# EAGLE design MersenneTwister (EAGLE 6.3)
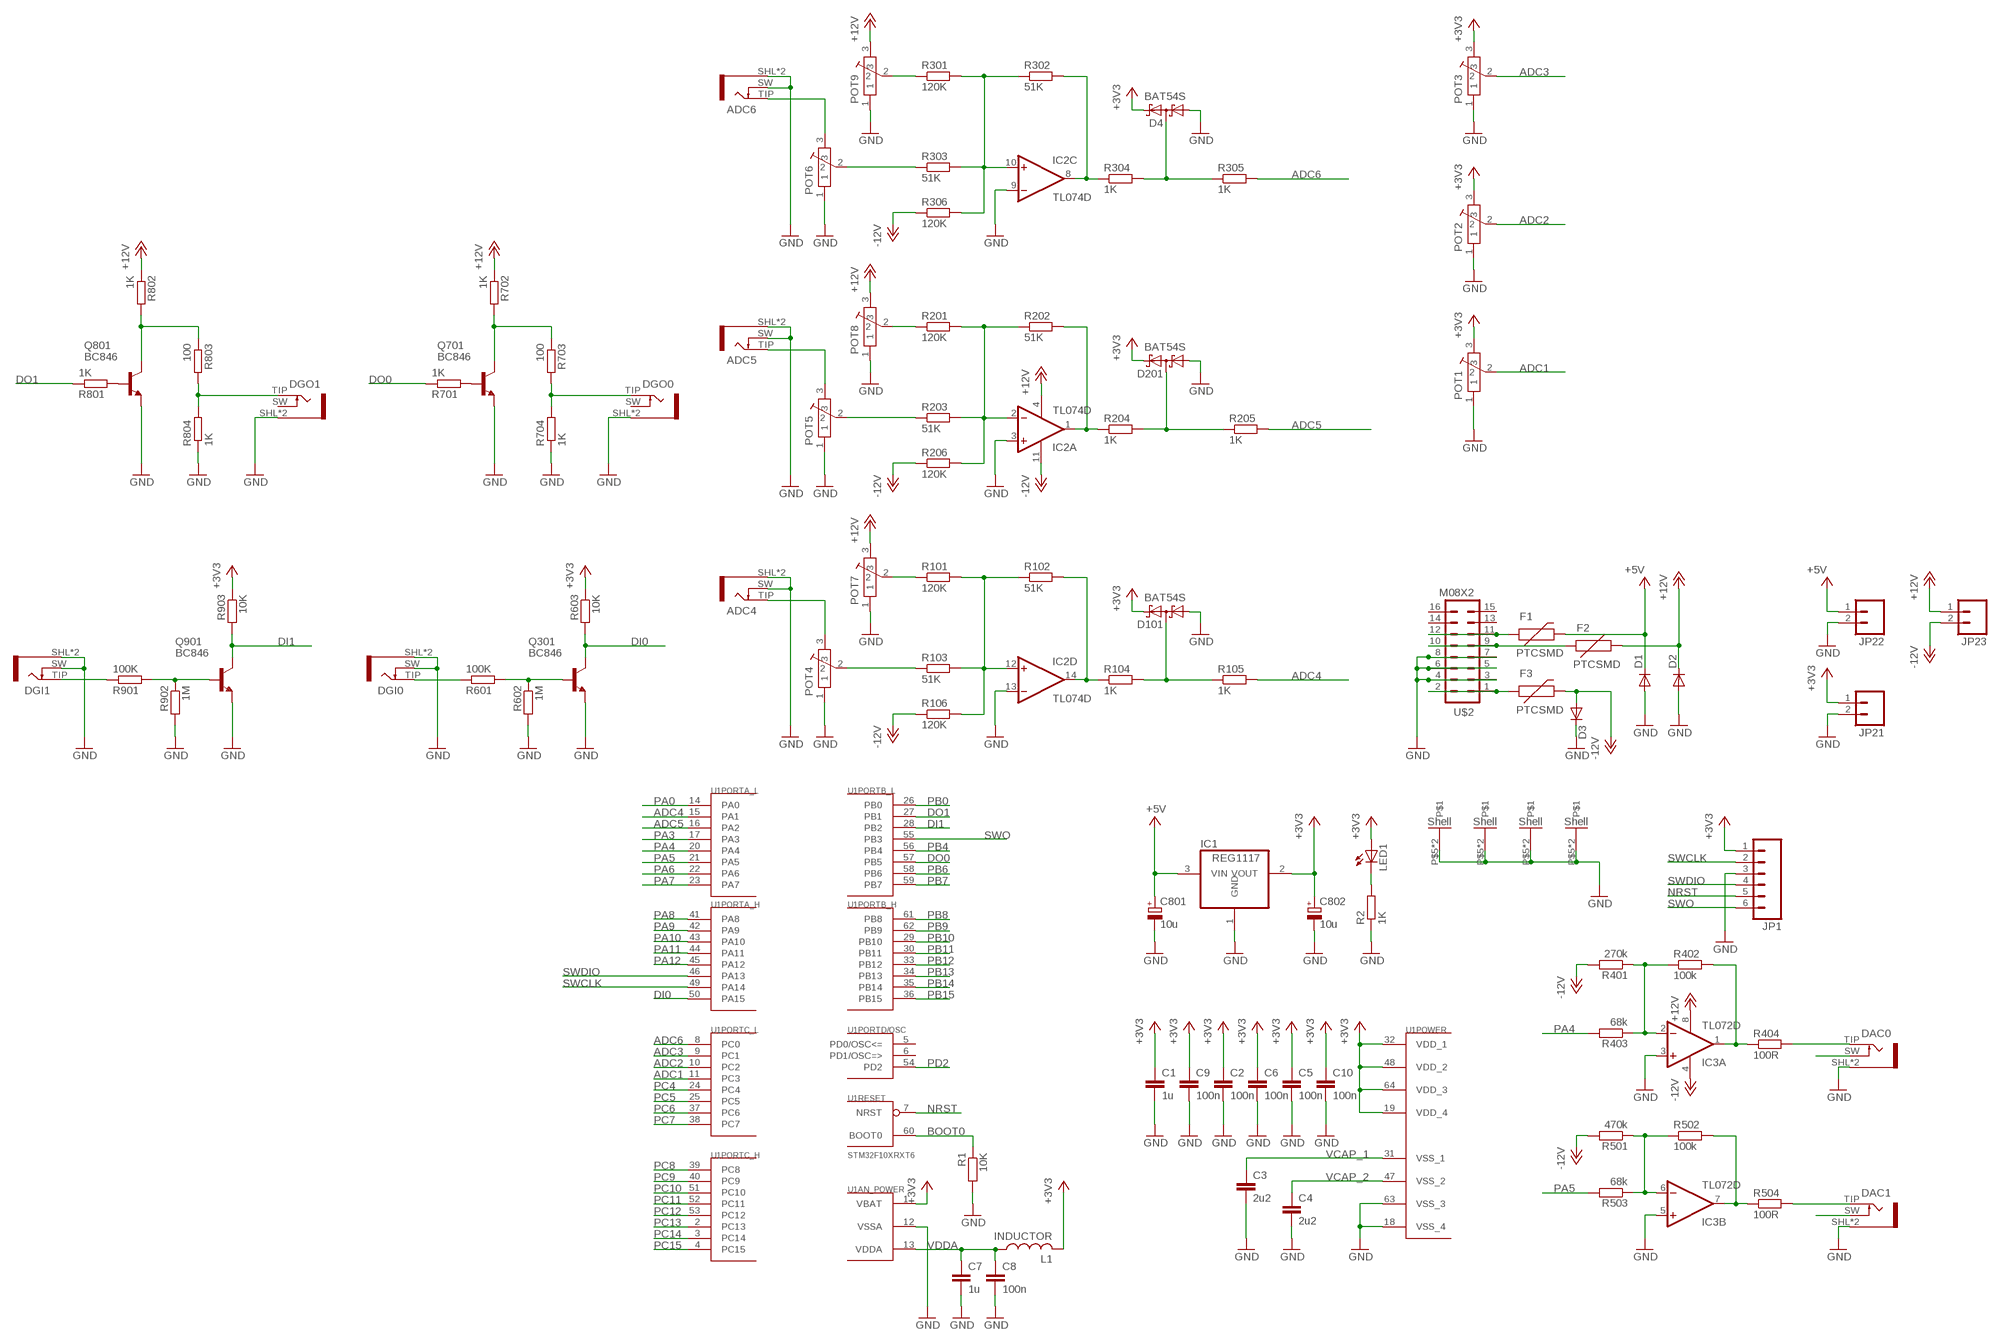
[diagram p0: schematic, sheet 1]

## Parts
ADC4  JACK-PJ-301B  [PJ-301B]
ADC5  JACK-PJ-301B  [PJ-301B]
ADC6  JACK-PJ-301B  [PJ-301B]
C1  1u  C-EUC0603  [C0603]
C2  100n  C-EUC0603  [C0603]
C3  2u2  C-EUC0603  [C0603]
C4  2u2  C-EUC0603  [C0603]
C5  100n  C-EUC0603  [C0603]
C6  100n  C-EUC0603  [C0603]
C7  1u  C-EUC0603  [C0603]
C8  100n  C-EUC0603  [C0603]
C9  100n  C-EUC0603  [C0603]
C10  100n  C-EUC0603  [C0603]
C801  10u  CPOL-EUA  [PANASONIC_A]
C802  10u  CPOL-EUA  [PANASONIC_A]
D1  DIODESMA  [SMA-DIODE]
D2  DIODESMA  [SMA-DIODE]
D3  DIODESMA  [SMA-DIODE]
D4  BAT54S  [SOT23]
D101  BAT54S  [SOT23]
D201  BAT54S  [SOT23]
DAC0  JACK-PJ-301B  [PJ-301B]
DAC1  JACK-PJ-301B  [PJ-301B]
DGI0  JACK-PJ-301B  [PJ-301B]
DGI1  JACK-PJ-301B  [PJ-301B]
DGO0  JACK-PJ-301B  [PJ-301B]
DGO1  JACK-PJ-301B  [PJ-301B]
F1  PTCSMD  [PTC-1206]
F2  PTCSMD  [PTC-1206]
F3  PTCSMD  [PTC-1206]
IC1  REG1117  [SOT223]
IC2  TL074D  [SO14]
IC3  TL072D  [SO08]
JP1  M06SIP  [1X06]
JP21  M02PTH  [1X02]
JP22  M02PTH  [1X02]
JP23  M02PTH  [1X02]
L1  INDUCTOR  [0603]
LED1  LEDCHIPLED_0603  [CHIPLED_0603]
POT1  POT-ALPS-RK09L1140  [POT-ALPS-RK09L1140]
POT2  POT-ALPS-RK09L1140  [POT-ALPS-RK09L1140]
POT3  POT-ALPS-RK09L1140  [POT-ALPS-RK09L1140]
POT4  POT-ALPS-RK09L1140  [POT-ALPS-RK09L1140]
POT5  POT-ALPS-RK09L1140  [POT-ALPS-RK09L1140]
POT6  POT-ALPS-RK09L1140  [POT-ALPS-RK09L1140]
POT7  POT-ALPS-RK09L1140  [POT-ALPS-RK09L1140]
POT8  POT-ALPS-RK09L1140  [POT-ALPS-RK09L1140]
POT9  POT-ALPS-RK09L1140  [POT-ALPS-RK09L1140]
Q301  BC846  [SOT23]
Q701  BC846  [SOT23]
Q801  BC846  [SOT23]
Q901  BC846  [SOT23]
R1  10K  R-EU_R0603  [R0603]
R2  1K  R-EU_R0603  [R0603]
R101  120K  R-EU_R0603  [R0603]
R102  51K  R-EU_R0603  [R0603]
R103  51K  R-EU_R0603  [R0603]
R104  1K  R-EU_R0603  [R0603]
R105  1K  R-EU_R0603  [R0603]
R106  120K  R-EU_R0603  [R0603]
R201  120K  R-EU_R0603  [R0603]
R202  51K  R-EU_R0603  [R0603]
R203  51K  R-EU_R0603  [R0603]
R204  1K  R-EU_R0603  [R0603]
R205  1K  R-EU_R0603  [R0603]
R206  120K  R-EU_R0603  [R0603]
R301  120K  R-EU_R0603  [R0603]
R302  51K  R-EU_R0603  [R0603]
R303  51K  R-EU_R0603  [R0603]
R304  1K  R-EU_R0603  [R0603]
R305  1K  R-EU_R0603  [R0603]
R306  120K  R-EU_R0603  [R0603]
R401  270k  R-EU_R0603  [R0603]
R402  100k  R-EU_R0603  [R0603]
R403  68k  R-EU_R0603  [R0603]
R404  100R  R-EU_R0603  [R0603]
R501  470k  R-EU_R0603  [R0603]
R502  100k  R-EU_R0603  [R0603]
R503  68k  R-EU_R0603  [R0603]
R504  100R  R-EU_R0603  [R0603]
R601  100K  R-EU_R0603  [R0603]
R602  1M  R-EU_R0603  [R0603]
R603  10K  R-EU_R0603  [R0603]
R701  1K  R-EU_R0603  [R0603]
R702  1K  R-EU_R0603  [R0603]
R703  100  R-EU_R0603  [R0603]
R704  1K  R-EU_R0603  [R0603]
R801  1K  R-EU_R0603  [R0603]
R802  1K  R-EU_R0603  [R0603]
R803  100  R-EU_R0603  [R0603]
R804  1K  R-EU_R0603  [R0603]
R901  100K  R-EU_R0603  [R0603]
R902  1M  R-EU_R0603  [R0603]
R903  10K  R-EU_R0603  [R0603]
U1  STM32F10XRXT6  [TQFP64]
U$2  M08X2  [2X8]

## Nets
+3V3: C1.1 C2.1 C5.1 C6.1 C9.1 C10.1 C802.+ D4.2(C2) D101.2(C2) D201.2(C2) IC1.2(VOUT) JP1.1 JP21.1 L1.2 LED1.A POT1.3 POT2.3 POT3.3 R603.1 R903.1 U1.1(AN_POWER:VBAT) U1.19(POWER:VDD_4) U1.32(POWER:VDD_1) U1.48(POWER:VDD_2) U1.64(POWER:VDD_3)
+5V: C801.+ D1.C F1.2 IC1.3(VIN) JP22.1
+12V: D2.C F2.2 IC2.4(P:V+) IC3.8(P:V+) JP23.1 POT7.3 POT8.3 POT9.3 R702.1 R802.1
-12V: D3.A F3.2 IC2.11(P:V-) IC3.4(P:V-) JP23.2 R106.1 R206.1 R306.1 R401.2 R501.2
ADC1: POT1.2 U1.11(PORTC_L:PC3)
ADC2: POT2.2 U1.10(PORTC_L:PC2)
ADC3: POT3.2 U1.9(PORTC_L:PC1)
ADC4: R105.2 U1.15(PORTA_L:PA1)
ADC5: R205.2 U1.16(PORTA_L:PA2)
ADC6: R305.2 U1.8(PORTC_L:PC0)
BOOT0: R1.1 U1.60(RESET:BOOT0)
DI0: Q301.3(C) R603.2 U1.50(PORTA_H:PA15)
DI1: Q901.3(C) R903.2 U1.28(PORTB_L:PB2)
DO0: R701.1 U1.57(PORTB_L:PB5)
DO1: R801.1 U1.27(PORTB_L:PB1)
GND: ADC4.SHL(SLEEVE) ADC4.SLV(SLEEVE) ADC4.SW ADC5.SHL(SLEEVE) ADC5.SLV(SLEEVE) ADC5.SW ADC6.SHL(SLEEVE) ADC6.SLV(SLEEVE) ADC6.SW C1.2 C2.2 C3.2 C4.2 C5.2 C6.2 C7.2 C8.2 C9.2 C10.2 C801.- C802.- D1.A D2.A D3.C D4.1(A1) D101.1(A1) D201.1(A1) DAC0.SHL(SLEEVE) DAC0.SLV(SLEEVE) DAC1.SHL(SLEEVE) DAC1.SLV(SLEEVE) DGI0.SHL(SLEEVE) DGI0.SLV(SLEEVE) DGI0.SW DGI1.SHL(SLEEVE) DGI1.SLV(SLEEVE) DGI1.SW DGO0.SHL(SLEEVE) DGO0.SLV(SLEEVE) DGO1.SHL(SLEEVE) DGO1.SLV(SLEEVE) IC1.1(GND) IC2.3(A:+IN) IC2.9(C:-IN) IC2.13(D:-IN) IC3.3(A:+IN) IC3.5(B:+IN) JP1.3 JP21.2 JP22.2 POT1.1 POT1.P$5 POT1.P$6 POT2.1 POT2.P$5 POT2.P$6 POT3.1 POT4.1 POT5.1 POT6.1 POT7.1 POT7.P$5 POT7.P$6 POT8.1 POT8.P$5 POT8.P$6 POT9.1 Q301.2(E) Q701.2(E) Q801.2(E) Q901.2(E) R1.2 R2.1 R602.2 R704.1 R804.1 R902.2 U1.12(AN_POWER:VSSA) U1.18(POWER:VSS_4) U1.63(POWER:VSS_3) U$2.3 U$2.4 U$2.5 U$2.6 U$2.7 U$2.8
N$1: ADC6.TIP POT6.3
N$2: IC2.12(D:+IN) R101.2 R102.1 R103.2 R106.2
N$3: POT7.2 R101.1
N$4: IC2.14(D:OUT) R102.2 R104.1
N$5: IC3.7(B:OUT) R502.2 R504.1
N$6: F3.1 U$2.1 U$2.2
N$7: IC3.1(A:OUT) R402.2 R404.1
N$8: DAC0.SW
N$9: IC2.10(C:+IN) R301.2 R302.1 R303.2 R306.2
N$10: Q901.1(B) R901.2 R902.1
N$11: Q801.1(B) R801.2
N$12: D201.3(C1A2) R204.2 R205.1
N$13: IC3.2(A:-IN) R401.1 R402.1 R403.1
N$14: IC2.2(A:-IN) R201.2 R202.1 R203.2 R206.2
N$15: POT8.2 R201.1
N$16: IC2.1(A:OUT) R202.2 R204.1
N$17: ADC5.TIP POT5.3
N$18: IC3.6(B:-IN) R501.1 R502.1 R503.1
N$19: LED1.C R2.2
N$20: D101.3(C1A2) R104.2 R105.1
N$21: DGI1.TIP R901.1
N$22: DGO1.TIP R803.2 R804.2
N$23: DGI0.TIP R601.1
N$24: Q801.3(C) R802.2 R803.1
N$25: POT5.2 R203.1
N$27: Q301.1(B) R601.2 R602.1
N$29: DAC1.SW
N$30: POT9.2 R301.1
N$31: DAC0.TIP R404.2
N$32: DAC1.TIP R504.2
N$33: IC2.8(C:OUT) R302.2 R304.1
N$34: Q701.1(B) R701.2
N$35: DGO0.TIP R703.2 R704.2
N$36: POT6.2 R303.1
N$37: D4.3(C1A2) R304.2 R305.1
N$38: Q701.3(C) R702.2 R703.1
N$39: ADC4.TIP POT4.3
N$40: POT4.2 R103.1
N$44: F1.1 U$2.11 U$2.12
N$45: F2.1 U$2.9 U$2.10
NRST: JP1.5 U1.7(RESET:NRST)
PA0: U1.14(PORTA_L:PA0)
PA3: U1.17(PORTA_L:PA3)
PA4: R403.2 U1.20(PORTA_L:PA4)
PA5: R503.2 U1.21(PORTA_L:PA5)
PA6: U1.22(PORTA_L:PA6)
PA7: U1.23(PORTA_L:PA7)
PA8: U1.41(PORTA_H:PA8)
PA9: U1.42(PORTA_H:PA9)
PA10: U1.43(PORTA_H:PA10)
PA11: U1.44(PORTA_H:PA11)
PA12: U1.45(PORTA_H:PA12)
PB0: U1.26(PORTB_L:PB0)
PB4: U1.56(PORTB_L:PB4)
PB6: U1.58(PORTB_L:PB6)
PB7: U1.59(PORTB_L:PB7)
PB8: U1.61(PORTB_H:PB8)
PB9: U1.62(PORTB_H:PB9)
PB10: U1.29(PORTB_H:PB10)
PB11: U1.30(PORTB_H:PB11)
PB12: U1.33(PORTB_H:PB12)
PB13: U1.34(PORTB_H:PB13)
PB14: U1.35(PORTB_H:PB14)
PB15: U1.36(PORTB_H:PB15)
PC4: U1.24(PORTC_L:PC4)
PC5: U1.25(PORTC_L:PC5)
PC6: U1.37(PORTC_L:PC6)
PC7: U1.38(PORTC_L:PC7)
PC8: U1.39(PORTC_H:PC8)
PC9: U1.40(PORTC_H:PC9)
PC10: U1.51(PORTC_H:PC10)
PC11: U1.52(PORTC_H:PC11)
PC12: U1.53(PORTC_H:PC12)
PC13: U1.2(PORTC_H:PC13)
PC14: U1.3(PORTC_H:PC14)
PC15: U1.4(PORTC_H:PC15)
PD2: U1.54(PORTD/OSC:PD2)
SWCLK: JP1.2 U1.49(PORTA_H:PA14)
SWDIO: JP1.4 U1.46(PORTA_H:PA13)
SWO: JP1.6 U1.55(PORTB_L:PB3)
VCAP_1: C3.1 U1.31(POWER:VSS_1)
VCAP_2: C4.1 U1.47(POWER:VSS_2)
VDDA: C7.1 C8.1 L1.1 U1.13(AN_POWER:VDDA)
Unconnected: DGO0.SW DGO1.SW IC2.5(B:+IN) IC2.6(B:-IN) IC2.7(B:OUT) POT3.P$5 POT3.P$6 POT4.P$5 POT4.P$6 POT5.P$5 POT5.P$6 POT6.P$5 POT6.P$6 POT9.P$5 POT9.P$6 U1.5(PORTD/OSC:PD0/OSC<=) U1.6(PORTD/OSC:PD1/OSC=>) U$2.13 U$2.14 U$2.15 U$2.16

## Library data of the parts
ADC4-ADC6 DAC0 DAC1 DGI0 DGI1 DGO0 DGO1 = Rebel:JACK-PJ-301B
C1-C10 = resistor:C-EU: CAPACITOR, European symbol
C801 C802 = resistor:CPOL-EU: POLARIZED CAPACITOR, European symbol
D1-D3 = SparkFun:DIODE: Diode These are standard reverse protection diodes and small signal diodes. SMA package can handle up to about 1A. SOD-323 can handle about 200mA. What the SOD-323 package when ordering, there are some mfgs out there that are 5-pin packages.
D4 D101 D201 = diode:BAT54S: Schottky Diodes Pin connection corrected 2011-05-04 Source: Fairchild .. BAT54.pdf
F1-F3 = SparkFun:PTC: Resettable Fuse PTC Resettable Fuse. Spark Fun Electronics SKU : COM-08357
IC1 = burr-brown:REG1117: 800mA and 1A Low Dropout (LDO) Positive Regulator 1.8V, 2.5V, 2.85V, 3.3V, 5V, and Adj; MPN: REG1117; OC_FARNELL: 1097566; OC_NEWARK: 14P6981
IC2 = linear:TL074: OP AMP
IC3 = linear:TL072: OP AMP
JP1 = SparkFun:M06: Header 6 Standard 6-pin 0.1" header. Use with straight break away headers (SKU : PRT-00116), right angle break away headers (PRT-00553), swiss pins (PRT-00743), machine pins (PRT-00117), and female headers (PRT-00115). Molex polarized connector foot print use with SKU : PRT-08094 with associated crimp pins and housings. NOTES ON THE VARIANTS LOCK and LOCK_LONGPADS... This footprint was designed to help hold the alignment of a through-hole component (i.e. 6-pin header) while soldering it into place. You may notice that each hole has been shifted either up or down by 0.005 of an inch from it's more standard position (which is a perfectly straight line). This slight alteration caused the pins (the squares in the middle) to touch the edges of the holes. Because they are alternating, it causes a "brace" to hold the component in place. 0.005 has proven to be the perfect amount of "off-center" position when using our standard breakaway headers. Although looks a little odd when you look at the bare footprint, once you have a header in there, the alteration is very hard to notice. Also, if you push a header all the way into place, it is covered up entirely on the bottom side. This idea of altering the position of holes to aid alignment will be further integrated into the Sparkfun Library for other footprints. It can help hold any component with 3 or more connection pins.
JP21-JP23 = SparkFun:M02: Header 2 Standard 2-pin 0.1" header. Use with straight break away headers (SKU : PRT-00116), right angle break away headers (PRT-00553), swiss pins (PRT-00743), machine pins (PRT-00117), and female headers (PRT-00115). Molex polarized connector foot print use with SKU : PRT-08233 with associated crimp pins and housings.
L1 = Rebel:INDUCTOR
LED1 = led:LED: LED OSRAM: - CHIPLED LG R971, LG N971, LY N971, LG Q971, LY Q971, LO R971, LY R971 LH N974, LH R974 LS Q976, LO Q976, LY Q976 LO Q996 - Hyper CHIPLED LW Q18S LB Q993, LB Q99A, LB R99A - SideLED LS A670, LO A670, LY A670, LG A670, LP A670 LB A673, LV A673, LT A673, LW A673 LH A674 LY A675 LS A676, LA A676, LO A676, LY A676, LW A676 LS A679, LY A679, LG A679 - Hyper Micro SIDELED® LS Y876, LA Y876, LO Y876, LY Y876 LT Y87S - SmartLED LW L88C, LW L88S LB L89C, LB L89S, LG L890 LS L89K, LO L89K, LY L89K LS L896, LA L896, LO L896, LY L896 - TOPLED LS T670, LO T670, LY T670, LG T670, LP T670 LSG T670, LSP T670, LSY T670, LOP T670, LYG T670 LG T671, LOG T671, LSG T671 LB T673, LV T673, LT T673, LW T673 LH T674 LS T676, LA T676, LO T676, LY T676, LB T676, LH T676, LSB T676, LW T676 LB T67C, LV T67C, LT T67C, LS T67K, LO T67K, LY T67K, LW E67C LS E67B, LA E67B, LO E67B, LY E67B, LB E67C, LV E67C, LT E67C LW T67C LS T679, LY T679, LG T679 LS T770, LO T770, LY T770, LG T770, LP T770 LB T773, LV T773, LT T773, LW T773 LH T774 LS E675, LA E675, LY E675, LS T675 LS T776, LA T776, LO T776, LY T776, LB T776 LHGB T686 LT T68C, LB T68C - Hyper Mini TOPLED® LB M676 - Mini TOPLED Santana® LG M470 LS M47K, LO M47K, LY M47K Source: http://www.osram.convergy.de LUXEON: - LUMILED® LXK2-PW12-R00, LXK2-PW12-S00, LXK2-PW14-U00, LXK2-PW14-V00 LXK2-PM12-R00, LXK2-PM12-S00, LXK2-PM14-U00 LXK2-PE12-Q00, LXK2-PE12-R00, LXK2-PE12-S00, LXK2-PE14-T00, LXK2-PE14-U00 LXK2-PB12-K00, LXK2-PB12-L00, LXK2-PB12-M00, LXK2-PB14-N00, LXK2-PB14-P00, LXK2-PB14-Q00 LXK2-PR12-L00, LXK2-PR12-M00, LXK2-PR14-Q00, LXK2-PR14-R00 LXK2-PD12-Q00, LXK2-PD12-R00, LXK2-PD12-S00 LXK2-PH12-R00, LXK2-PH12-S00 LXK2-PL12-P00, LXK2-PL12-Q00, LXK2-PL12-R00 Source: www.luxeon.com KINGBRIGHT: KA-3528ASYC Source: www.kingbright.com
POT1-POT9 = Rebel:POT-ALPS-RK09L
Q301 Q701 Q801 Q901 = transistor:BC846: NPN TRANSISTOR
R1 R2 R101-R106 R201-R206 R301-R306 R401-R404 R501-R504 R601-R603 R701-R704 R801-R804 R901-R903 = resistor:R-EU_: RESISTOR, European symbol
U1 = stm32:STM32F10XRXT6: STM32F101/103 64pin LQFP
U$2 = SparkFun:M08X2

## Board
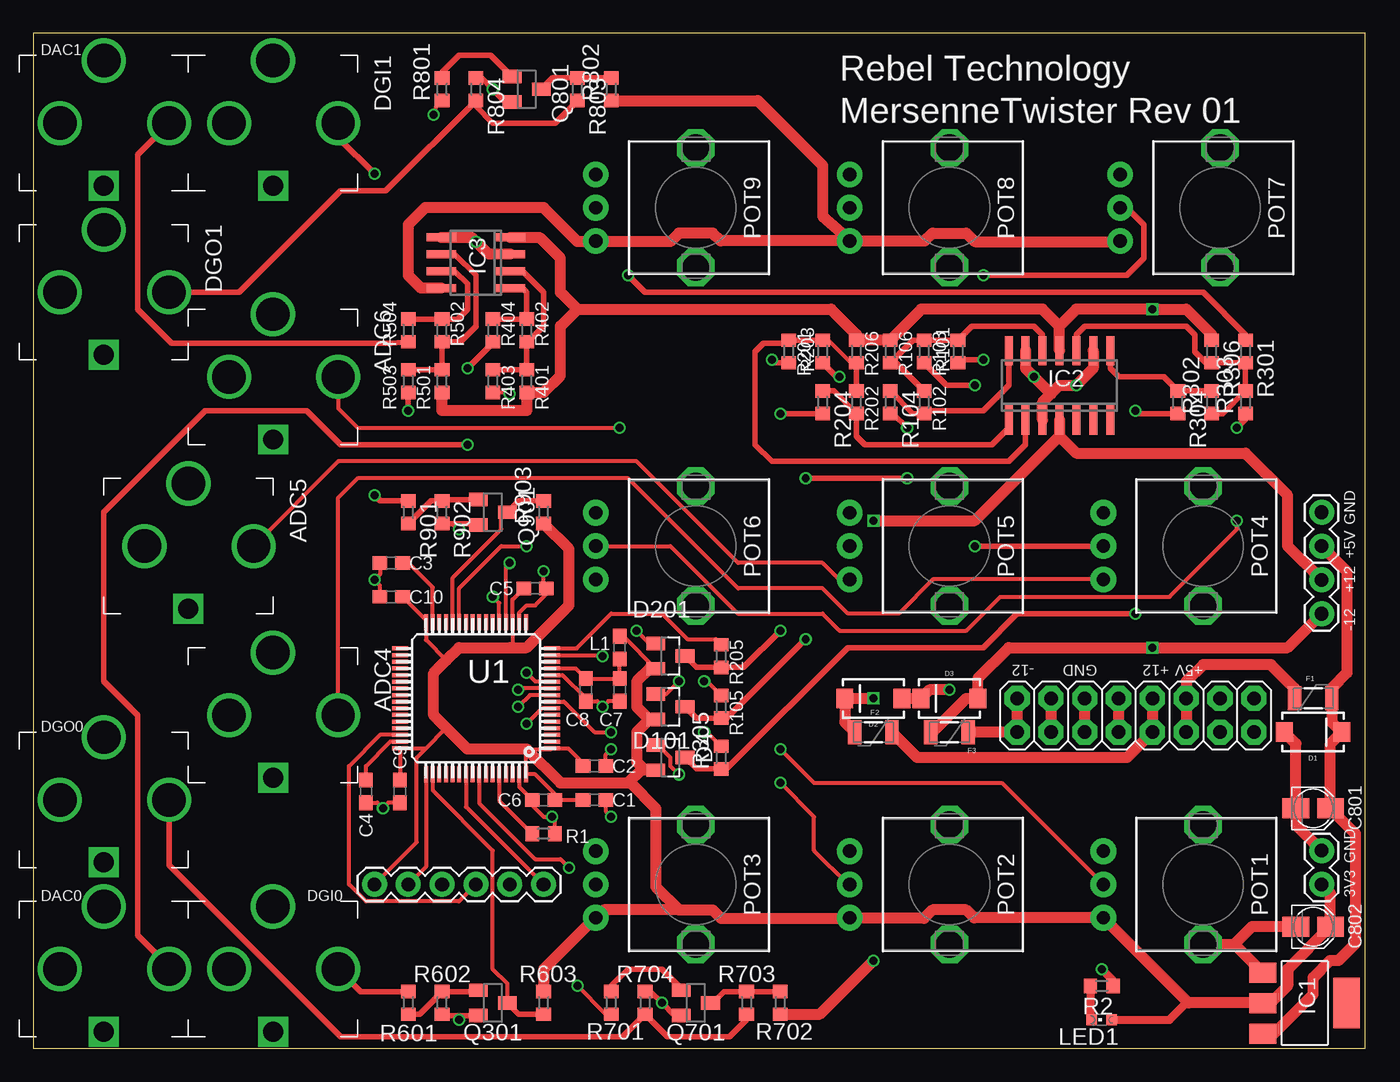
[diagram p1: board, top side]
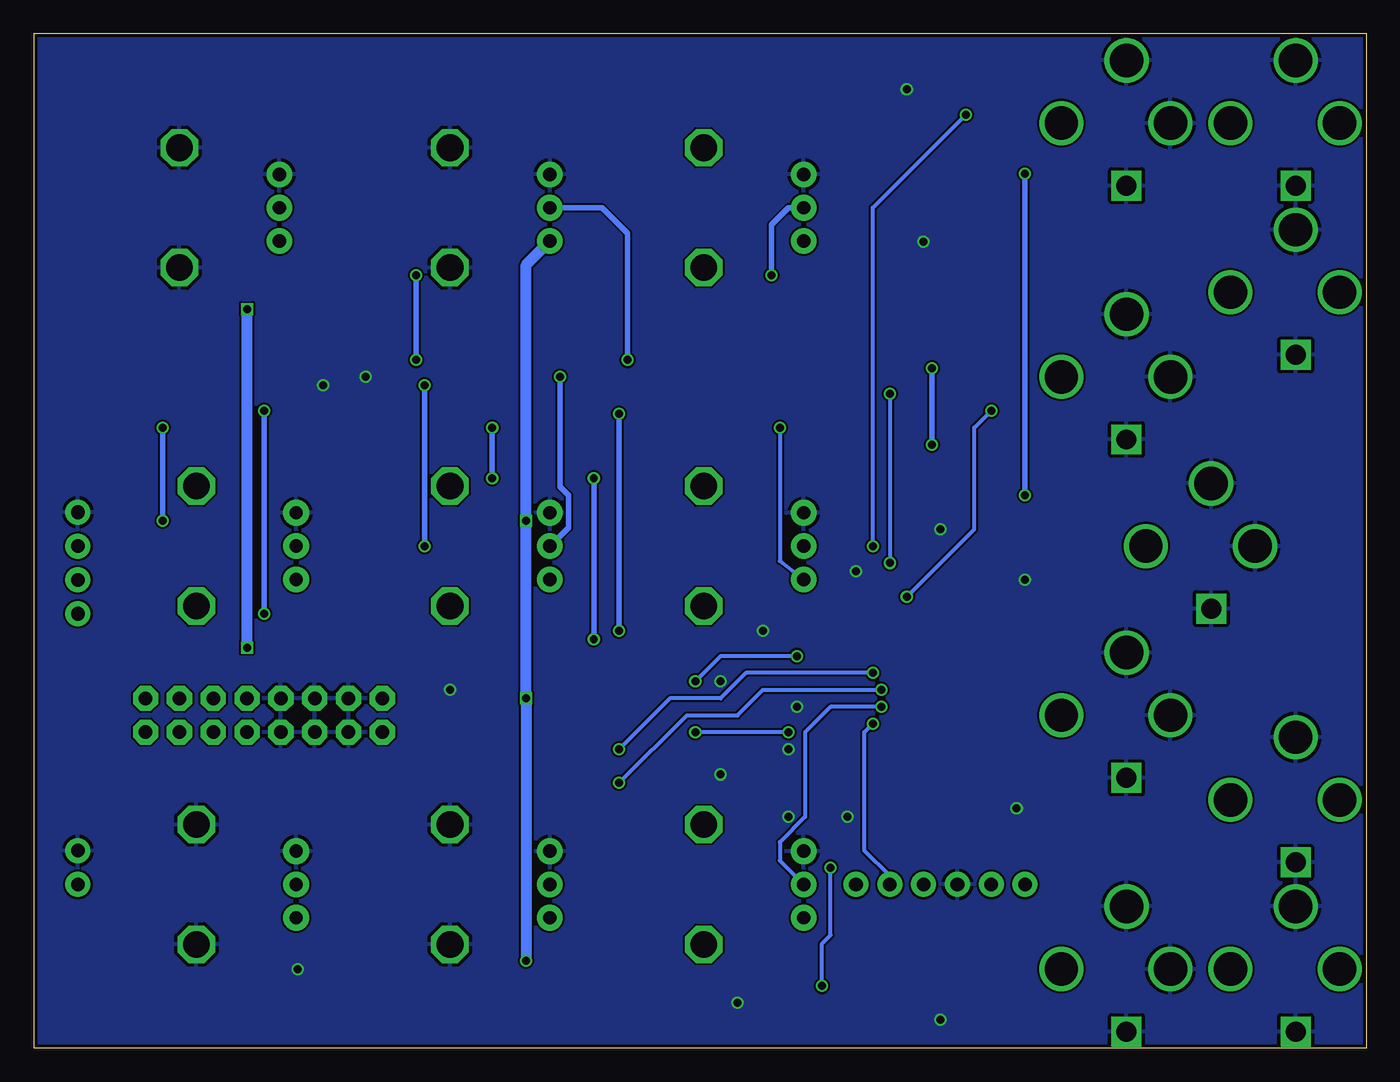
[diagram p2: board, bottom side, seen from below]

Size 100 x 76.19 mm. Coordinates in mm from the lower left corner, seen from the top.
Outline: 0,0 100,0 100,76.19 0,76.19 0,0
Copper layers (1*16): Top 0.035mm / dielectric 1.5mm / Bottom 0.035mm
Design rules "Rebel *": minimum track width 6mil, minimum drill 12mil, track to track 6mil, track to pad 6mil, pad to pad 6mil, via to via 6mil, smd to smd 0mil, copper to edge 10mil, drill to drill 10mil, minimum pad ring 12mil, minimum via ring 6mil, stop-mask expansion 2mil, vias tented up to drill 100mil, thermal gap 10mil

### Footprints (pad centres in the part's own frame; a part is rotated, then mirrored left to right if it is on the bottom)
PJ-301B = drill 1.5 square: SHL 4.7,0 | drill 2.5: SLV -4.7,0; SW 0,-3.3; TIP 0,4.9
C0603 = smd 1.1 x 1: 1 -0.85,0; 2 0.85,0
PANASONIC_A = smd 2 x 1.5: + 1.3,0; - -1.3,0
SMA-DIODE = smd 1.27 x 1.47: A -2.15,0; C 2.15,0
SOT23 = smd 1 x 1.4: 1 -0.95,-1.1; 2 0.95,-1.1; 3 0,1.1
PTC-1206 = smd 1 x 1.8: 1 -1.4,0; 2 1.4,0
SOT223 = smd 1.499 x 2.007: 1 -2.261,-3.15; 2 0.025,-3.15; 3 2.311,-3.15 | smd 3.81 x 2.007: 4 0,3.15
SO14 = smd 0.6 x 2.2: 1 -3.81,-2.6; 2 -2.54,-2.6; 3 -1.27,-2.6; 4 0,-2.6; 5 1.27,-2.6; 6 2.54,-2.6; 7 3.81,-2.6; 8 3.81,2.6; 9 2.54,2.6; 10 1.27,2.6; 11 0,2.6; 12 -1.27,2.6; 13 -2.54,2.6; 14 -3.81,2.6
SO08 = smd 0.6 x 2.2: 1 -1.905,-2.6; 2 -0.635,-2.6; 3 0.635,-2.6; 4 1.905,-2.6; 5 1.905,2.6; 6 0.635,2.6; 7 -0.635,2.6; 8 -1.905,2.6
1X06 = drill 1.016 pad 1.88: 1 0,0; 2 2.54,0; 3 5.08,0; 4 7.62,0; 5 10.16,0; 6 12.7,0
1X02 = drill 1.016 pad 1.88: 1 0,0; 2 2.54,0
0603 = smd 1.1 x 1: 1 -0.85,0; 2 0.85,0
CHIPLED_0603 = smd 0.8 x 0.8: A 0,-0.75; C 0,0.75
POT-ALPS-RK09L1140 = drill 1 pad 1.93: 1 -2.5,-7.5; 2 0,-7.5; 3 2.5,-7.5 | drill 2 octagon: P$5 -4.5,0; P$6 4.5,0
R0603 = smd 1 x 1.1: 1 -0.85,0; 2 0.85,0
TQFP64 = smd 1.2 x 0.3: 1 -5.7,3.75; 2 -5.7,3.25; 3 -5.7,2.75; 4 -5.7,2.25; 5 -5.7,1.75; 6 -5.7,1.25; 7 -5.7,0.75; 8 -5.7,0.25; 9 -5.7,-0.25; 10 -5.7,-0.75; 11 -5.7,-1.25; 12 -5.7,-1.75; 13 -5.7,-2.25; 14 -5.7,-2.75; 15 -5.7,-3.25; 16 -5.7,-3.75; 33 5.7,-3.75; 34 5.7,-3.25; 35 5.7,-2.75; 36 5.7,-2.25; 37 5.7,-1.75; 38 5.7,-1.25; 39 5.7,-0.75; 40 5.7,-0.25; 41 5.7,0.25; 42 5.7,0.75; 43 5.7,1.25; 44 5.7,1.75; 45 5.7,2.25; 46 5.7,2.75; 47 5.7,3.25; 48 5.7,3.75 | smd 0.3 x 1.2: 17 -3.75,-5.7; 18 -3.25,-5.7; 19 -2.75,-5.7; 20 -2.25,-5.7; 21 -1.75,-5.7; 22 -1.25,-5.7; 23 -0.75,-5.7; 24 -0.25,-5.7; 25 0.25,-5.7; 26 0.75,-5.7; 27 1.25,-5.7; 28 1.75,-5.7; 29 2.25,-5.7; 30 2.75,-5.7; 31 3.25,-5.7; 32 3.75,-5.7; 49 3.75,5.7; 50 3.25,5.7; 51 2.75,5.7; 52 2.25,5.7; 53 1.75,5.7; 54 1.25,5.7; 55 0.75,5.7; 56 0.25,5.7; 57 -0.25,5.7; 58 -0.75,5.7; 59 -1.25,5.7; 60 -1.75,5.7; 61 -2.25,5.7; 62 -2.75,5.7; 63 -3.25,5.7; 64 -3.75,5.7
2X8 = drill 1.016 pad 1.88 octagon: 1 0,0; 2 0,2.54; 3 2.54,0; 4 2.54,2.54; 5 5.08,0; 6 5.08,2.54; 7 7.62,0; 8 7.62,2.54; 9 10.16,0; 10 10.16,2.54; 11 12.7,0; 12 12.7,2.54; 13 15.24,0; 14 15.24,2.54; 15 17.78,0; 16 17.78,2.54

### Placement (x,y rotation side)
ADC4  18,25 270 top
ADC5  11.65,37.7 270 top
ADC6  18,50.4 270 top
C1  42.13,18.65 0 top
C2  42.13,21.19 0 top
C3  26.89,36.43 180 top
C4  24.98,19.29 270 top
C5  37.68,34.52 0 top
C6  38.32,18.65 180 top
C7  44.03,26.91 270 top
C8  41.49,26.91 270 top
C9  27.52,19.29 270 top
C10  26.89,33.89 180 top
C801  96.1,18.02 0 top
C802  96.1,9.12 0 top
D1  96.1,23.73 0 top
D2  63.08,26.27 180 top
D3  68.8,26.27 180 top
D4  47.84,21.83 270 top
D101  47.84,25.64 270 top
D201  47.84,29.45 270 top
DAC0  5.3,5.95 270 top
DAC1  5.3,69.45 270 top
DGI0  18,5.95 270 top
DGI1  18,69.45 270 top
DGO0  5.3,18.65 270 top
DGO1  5.3,56.75 270 top
F1  96.1,26.27 0 top
F2  63.08,23.73 180 top
F3  68.8,23.73 180 top
IC1  95.47,3.41 270 top
IC2  77.05,49.77 0 top
IC3  33.24,58.97 90 top
JP1  25.62,12.3 0 top
JP21  96.74,12.3 90 top
JP22  96.74,37.7 90 top
JP23  96.74,35.16 270 top
L1  44.03,30.08 90 top
LED1  80.23,2.14 90 top
POT1  87.85,12.3 270 top
POT2  68.8,12.3 270 top
POT3  49.75,12.3 270 top
POT4  87.85,37.7 270 top
POT5  68.8,37.7 270 top
POT6  49.75,37.7 270 top
POT7  89.12,63.1 270 top
POT8  68.8,63.1 270 top
POT9  49.75,63.1 270 top
Q301  34.51,3.41 270 top
Q701  49.75,3.41 270 top
Q801  37.05,71.99 270 top
Q901  34.51,40.24 270 top
R1  38.32,16.11 0 top
R2  80.23,4.68 180 top
R101  69.43,52.3 90 top
R102  66.89,48.5 270 top
R103  66.89,52.3 90 top
R104  64.35,48.5 270 top
R105  51.65,25.64 90 top
R106  64.35,52.3 270 top
R201  56.73,52.3 90 top
R202  61.81,48.5 270 top
R203  59.27,52.3 90 top
R204  59.27,48.5 270 top
R205  51.65,29.45 90 top
R206  61.81,52.3 270 top
R301  91.02,52.3 270 top
R302  88.48,48.5 90 top
R303  91.02,48.5 90 top
R304  85.94,48.5 270 top
R305  51.65,21.83 90 top
R306  88.48,52.3 270 top
R401  37.05,50.08 270 top
R402  37.05,53.89 90 top
R403  34.51,50.08 270 top
R404  34.51,53.89 270 top
R501  30.7,50.08 270 top
R502  30.7,53.89 90 top
R503  28.16,50.08 270 top
R504  28.16,53.89 270 top
R601  28.16,3.41 270 top
R602  30.7,3.41 270 top
R603  38.32,3.41 270 top
R701  43.4,3.41 90 top
R702  56.1,3.41 90 top
R703  53.56,3.41 270 top
R704  45.94,3.41 270 top
R801  30.7,71.99 90 top
R802  43.4,71.99 90 top
R803  40.86,71.99 270 top
R804  33.24,71.99 270 top
R901  28.16,40.24 270 top
R902  30.7,40.24 270 top
R903  38.32,40.24 90 top
U1  33.24,26.27 180 top
U$2  73.88,23.73 0 top
U$3  [RT-LOGO-35MM-BL]  64.03,69.77 0 top

### Tracks (layer width: path | path; a pad name or v marks a point on that pad's centre or on a via)
+3V3
  Top 0.305: C5.1 35.99,33.68 U1.19 35.99,30.29 35.78,30.08 | C10.1 29.49,32.14 U1.32 29.49,30.66 31.01,29.13 | 29.43,22.52 U1.48 27.54,20.15 C9.1 | 29.43,22.52 29.49,22.52 31.01,24.05 | C2.1 41.28,21.41 40.16,22.52 U1.1 38.88,22.46 37.05,22.46 36.99,22.4 U1.64 37,20.55 37.68,20.55 39.17,19.07 C6.1 C1.1 | JP1.1 28.79,15.47 28.79,21.83 29.43,22.46 29.43,22.52 | POT3.3 42.17,9.8 | D201.2 44.31,30.93 L1.2
  Top 0.61: LED1.A 85.31,2.14 86.66,3.49
  Top 0.813: 92.34,3.41 92.93,3.41 94.2,4.68 94.2,5.95 97.37,9.12 C802.+ 97.4,11.63 JP21.1 | 92.34,3.41 IC1.2 | 92.34,3.41 86.74,3.41 86.66,3.49 POT1.3 70.66,9.8 70.07,10.39 67.53,10.39 66.89,9.76 61.34,9.76 POT2.3 61.26,9.76 51.65,9.76 51.02,10.39 48.48,10.39 | 44.67,19.92 39.59,19.92 37.05,22.46 32.6,22.46 31.01,24.05 30.06,25 30.06,28.18 31.01,29.13 31.97,30.08 35.78,30.08 37.05,30.08 40.22,33.26 40.22,37.48 R903.1 | 44.67,19.92 44.84,19.92 46.74,18.02 46.74,12.13 48.48,10.39 | 44.67,19.92 45.62,20.88 45.94,20.88 | D4.2 45.94,20.88 | 45.94,20.88 45.3,21.51 45.3,23.73 46.26,24.69 D101.2 46.25,24.69 45.3,25.64 45.3,27.54 46.26,28.5 D201.2 | 42.17,9.8 38.32,5.95 R603.1 | 48.48,10.39 42.84,10.39 POT3.3
+5V
  Top 0.813: JP22.1 98.64,35.8 98.64,28.18 97.5,27.04 F1.2 97.5,24.48 D1.C 97.4,22.88 C801.+ 97.4,17.99 99.28,16.11 99.28,7.86 98.01,6.58 97.37,6.58 96.1,5.31 96.1,4.04 93.16,1.1 IC1.3
+12V  (via drill 0.6)
  Top 0.813: 61.68,60.22 POT8.3 | POT8.3 66.93,60.6 67.53,61.2 70.07,61.2 70.7,60.56 81.58,60.56 POT7.3 | POT8.3 51.61,60.6 51.02,61.2 48.48,61.2 47.84,60.56 42.29,60.56 POT9.3 42.21,60.56 40.86,60.56 38.32,63.1 29.43,63.1 28.16,61.83 28.16,58.02 29.11,57.07 IC3.8 | v63.08,39.61 70.7,39.61 77.05,45.95 | IC2.4 77.05,45.95 | R702.1 59.06,2.56 v63.08,6.58 | JP23.1 94.2,37.7 94.2,41.51 91.02,44.69 78.32,44.69 77.05,45.95 | F2.2 60.93,24.48 D2.C v63.08,26.27 | R802.1 54.41,71.14 59.27,66.27 59.27,62.47 61.3,60.68 POT8.3
  Bottom 0.813: POT8.3 63.08,58.82 v63.08,39.61 v63.08,26.27 v63.08,6.58
-12V  (via drill 0.6)
  Top 0.813: 36.09,60.88 IC3.4 38,60.88 39.59,59.29 39.59,56.75 40.86,55.48 | 40.86,55.48 59.91,55.48 61.81,53.58 R206.1 R106.1 66.68,55.48 75.78,55.48 77.05,54.21 | R306.1 88.48,53.58 86.58,55.48 v84.04,55.48 78.32,55.48 77.05,54.21 | IC2.11 77.05,54.21 | JP23.2 94.2,30.08 v84.04,30.08 73.24,30.08 70.95,27.79 D3.A 70.07,26.27 67.53,23.73 F3.2 | R501.2 30.7,47.86 37.05,47.86 R401.2 38.32,49.23 39.59,50.5 39.59,54.21 40.86,55.48
  Bottom 0.813: v84.04,30.08 v84.04,55.48
ADC1  (via drill 0.6)
  Top 0.305: U1.11 37.7,27.52 v37.05,28.18 | v56.1,22.46 58.64,19.92 72.73,19.92 POT1.2
  Bottom 0.305: v37.05,28.18 46.57,28.18 48.48,26.27 52.29,26.27 v56.1,22.46
ADC2  (via drill 0.6)
  Top 0.305: POT2.2 61.18,12.3 58.64,14.84 58.64,17.38 v56.1,19.92 | U1.10 36.53,27.02 v36.41,26.91
  Bottom 0.305: v56.1,19.92 51.02,25 47.21,25 45.3,26.91 v36.41,26.91
ADC3  (via drill 0.6)
  Top 0.305: U1.9 37.3,26.52 v36.41,25.64
  Bottom 0.305: v36.41,25.64 40.22,25.64 42.13,23.73 42.13,17.38 44.03,15.47 44.03,14.08 POT3.2
ADC4  (via drill 0.6)
  Top 0.305: U1.15 42.69,29.52 v42.76,29.45 | v50.38,27.54 50.6,27.54 R105.2
  Bottom 0.305: v42.76,29.45 48.48,29.45 v50.38,27.54
ADC5
  Top 0.305: U1.16 40.8,30.02 43.4,32.62 47.21,32.62 49.11,30.71 51.23,30.71 R205.2
ADC6  (via drill 0.6)
  Top 0.305: v43.4,23.73 42.13,23.73 39.84,26.02 U1.8 | v50.38,23.73 50.6,23.73 R305.2
  Bottom 0.305: v43.4,23.73 v50.38,23.73
BOOT0
  Top 0.305: U1.60 34.99,18.59 R1.1
DI0
  Top 0.305: Q301.3 35.61,4.85 34.51,5.95 34.51,14.84 29.99,19.36 U1.50
  Top 0.406: R603.2 36.46,2.56 Q301.3
DI1
  Top 0.305: Q901.3 35.14,39.77 35.14,38.97 31.49,35.32 U1.28
  Top 0.406: R903.2 36.46,41.09 Q901.3
DO0  (via drill 0.6)
  Top 0.305: U1.57 33.49,18.4 37.68,14.21 39.59,14.21 v40.22,13.57 | R701.1 42.98,2.56 v40.86,4.68
  Bottom 0.305: v40.86,4.68 40.86,7.86 40.22,8.49 v40.22,13.57
DO1  (via drill 0.6)
  Top 0.305: U1.27 31.99,34.55 35.14,37.7 v37.05,37.7 | v30.06,70.08 30.28,70.72 R801.1
  Bottom 0.305: v37.05,37.7 37.05,63.1 v30.06,70.08
GND  (via drill 0.6)
  Top 0.305: U1.18 36.49,32.7 37.05,33.26 37.68,33.26 38.53,34.11 C5.2 | U1.12 39.74,28.02 41.49,26.27 C8.2 42.34,26.05 v42.76,25.64 43.18,26.05 C7.2 | D101.1 47.52,26.59 v48.48,27.54 | D201.1 46.25,30.4 v45.3,31.35 | U1.63 36.49,19.63 C6.2 37.47,18.23 38.32,17.38 v38.95,17.38 39.17,17.17 R1.2 | C4.2 25.83,18.44 v26.25,18.02 26.67,18.44 C9.2 | C3.2 26.04,35.58 v25.62,35.16 26.04,34.74 C10.2 | C2.2 42.98,22.04 v43.4,22.46 | C1.2 42.98,17.8 v43.4,17.38 | D4.1 46.89,22.78 47.84,21.83 47.84,21.19 v48.48,20.55 | 38.32,34.52 v38.32,35.8 | R2.1 81.08,5.1
  Top 0.406: Q901.2 33.31,39.39 R902.2 31.55,39.39 v31.97,38.97 | R602.2 30.8,2.46 Q301.2 32.29,2.46 v31.97,2.14 | R804.1 33.66,72.84 v34.51,71.99 35.78,70.72 35.78,70.87 Q801.2 | R704.1 46.36,4.26 v47.21,3.41 48.16,2.46 Q701.2 | C5.2 38.32,34.52
  Top 0.61: 81.08,5.1 v80.23,5.95
  Top 0.813: POT1.P$6 90.19,7.8 | 90.19,7.8 IC1.1 | C802.- 91.51,9.12 90.19,7.8 | D2.A D3.C | D1.A 94.8,22.88 C801.- 94.8,16.78 JP21.2 | U$2.4 U$2.3 | U$2.5 U$2.6 | U$2.7 U$2.8 | D3.C 66.65,26.52 | IC3.5 32.92,60.88 v33.24,60.56 34.19,59.61 IC3.3 | IC2.9 79.59,51.04 v78.32,49.77 77.05,49.77 76.42,49.13 | IC2.3 75.78,48.5 76.42,49.13 | IC2.13 74.51,51.04 v75.15,50.4 76.42,49.13 | v68.8,26.91 67.28,26.91 D3.C
  pour Bottom: -1.05,-0.4 -1.05,77.7 99.91,77.7 99.91,-0.4
N$1  (via drill 0.6)
  Top 0.305: ADC6.TIP 22.9,48.04 24.35,46.59 v44.03,46.59
  Bottom 0.305: v44.03,46.59 44.03,36.59 POT6.3
N$2
  Top 0.406: IC2.12 75.78,53.58 75.15,54.21 70.49,54.21 R101.2 R103.2 66.05,53.16 R106.2 64.78,51.45 R102.1
N$3  (via drill 0.6)
  Top 0.406: POT7.2 82.13,63.1 83.4,61.83 83.4,59.29 82.13,58.02 v71.34,58.02 | v71.34,51.67 69.65,51.67 R101.1
  Bottom 0.406: v71.34,58.02 v71.34,51.67
N$4
  Top 0.406: IC2.14 73.24,49.77 71.34,47.86 67.11,47.86 R102.2 66.05,47.65 R104.1
N$5
  Top 0.406: R504.1 R502.2 31.86,54.74 32.6,55.48 32.6,57.38 31.65,58.34 IC3.7 29.74,58.34
N$6
  Top 0.813: U$2.2 U$2.1 F3.1
N$7
  Top 0.406: IC3.1 36.73,57.07 37.05,56.75 R402.2 R404.1
N$9
  Top 0.406: IC2.10 78.32,53.58 78.96,54.21 86.58,54.21 87.21,53.58 87.21,52.3 88.06,51.45 R306.2 R301.2 R303.2 89.32,47.65 R302.1
N$10
  Top 0.406: Q901.1 30.8,41.19 R902.1 29.86,41.09 R901.2
N$11
  Top 0.406: R801.2 30.7,73.26 31.97,74.53 34.36,74.53 Q801.1
N$12  (via drill 0.6)
  Top 0.406: D201.3 49.79,28.6 R205.1 53.34,28.6 v56.1,31.35 | v56.1,47.65 R204.2
  Bottom 0.406: v56.1,31.35 v56.1,47.65
N$13
  Top 0.406: R403.1 R401.1 R402.1 37.15,53.04 38.32,54.21 38.32,56.75 36.73,58.34 IC3.2 34.82,58.34
N$14
  Top 0.305: R206.2 61.39,51.45 59.69,53.16 R203.2 | 56.52,52.94 R201.2
  Top 0.406: R206.2 R202.1 | R201.2 R203.2 | 56.52,52.94 54.83,52.94 54.19,52.3 54.19,45.32 55.46,44.05 73.24,44.05 74.51,45.32 IC2.2
N$15  (via drill 0.6)
  Top 0.406: R201.1 55.68,51.45 v55.46,51.67
  Bottom 0.406: POT8.2 57.37,63.1 55.46,61.2 v55.46,51.67
N$16
  Top 0.406: R204.1 60.11,49.34 R202.2 61.81,45.95 62.45,45.32 71.97,45.32 73.24,46.59 IC2.1
N$17
  Top 0.305: POT5.3 60.5,35.2 59.27,36.43 52.92,36.43 45.3,44.05 22.9,44.05 ADC5.TIP
N$18
  Top 0.406: R503.1 R501.1 R502.1 32.07,53.04 33.24,54.21 33.24,58.02 31.65,59.61 IC3.6
N$19
  Top 0.305: 79.38,2.24 LED1.C
  Top 0.61: R2.2 79.38,2.24
N$20  (via drill 0.6)
  Top 0.305: R104.2 64.57,47.65
  Top 0.406: D101.3 49.79,24.79 R105.1 52.07,24.79 v58,30.71 | v58,42.78 64.35,42.78 v65.62,42.78 | 64.57,47.65 v65.62,46.59
  Bottom 0.406: v58,42.78 v58,30.71 | v65.62,46.59 v65.62,42.78
N$21  (via drill 0.6)
  Top 0.406: DGI1.TIP 22.9,68.36 v25.62,65.64 | R901.1 26.04,41.09 v25.62,41.51
  Bottom 0.406: v25.62,65.64 v25.62,41.51
N$22
  Top 0.406: R803.2 39.17,69.45 34.51,69.45 33.24,70.72 R804.2 26.47,64.37 23.08,64.37 15.46,56.75 DGO1.TIP
N$23
  Top 0.406: R601.1 24.59,4.26 DGI0.TIP
N$24
  Top 0.406: Q801.3 39,72.84 R803.1 R802.2
N$25  (via drill 0.6)
  Top 0.406: R203.1 60.33,50.4 v60.54,50.4
  Bottom 0.406: v60.54,50.4 60.54,42.15 59.91,41.51 59.91,39.09 POT5.2
N$27
  Top 0.406: R601.2 29,2.56 R602.1 33.31,4.26 Q301.1
N$30  (via drill 0.6)
  Top 0.406: R301.1 91.02,53.58 87.85,56.75 45.94,56.75 v44.67,58.02
  Bottom 0.406: v44.67,58.02 44.67,61.83 43.4,63.1 POT9.2
N$31  (via drill 0.6)
  Top 0.406: R404.2 34.51,52.94 v32.6,51.04 | DAC0.TIP 9.11,7.04 9.11,7.22 7.84,8.49 7.84,25 5.3,27.54 5.3,40.24 12.92,47.86 20.54,47.86 23.08,45.32 v32.6,45.32
  Bottom 0.406: v32.6,51.04 v32.6,45.32
N$32
  Top 0.406: R504.2 28.26,53.04 26.89,52.94 10.38,52.94 7.84,55.48 7.84,67.09 DAC1.TIP
N$33
  Top 0.406: IC2.8 80.86,51.04 81.5,50.4 84.89,50.4 R304.1 R302.2
N$34
  Top 0.406: Q701.1 48.65,4.51 47.21,5.95 44.67,5.95 43.4,4.68 R701.2
N$35
  Top 0.406: R703.2 53.56,2.14 52.29,0.87 47.63,0.87 R704.2 44.25,0.87 23.08,0.87 10.2,13.75 DGO0.TIP
N$36  (via drill 0.6)
  Top 0.305: POT6.2 47.84,37.7 52.92,32.62 59.27,32.62 60.54,31.35 70.07,31.35 72.61,33.89 85.31,33.89 90.39,38.97 v90.39,39.61
  Top 0.406: v90.39,46.59 91.02,47.23 R303.1
  Bottom 0.406: v90.39,39.61 v90.39,46.59
N$37  (via drill 0.6)
  Top 0.406: D4.3 49.79,20.98 R305.1 52.07,20.98 61.18,30.08 71.34,30.08 73.88,32.62 v82.77,32.62 | R304.2 82.98,47.65 v82.77,47.86
  Bottom 0.406: v82.77,47.86 v82.77,32.62
N$38
  Top 0.406: R702.2 R703.1 51.87,4.26 51.02,3.41 Q701.3
N$39
  Top 0.305: POT4.3 67.57,35.2 64.99,32.62 61.18,32.62 59.27,34.52 52.92,34.52 44.67,42.78 24.35,42.78 22.9,41.33 ADC4.TIP
N$40  (via drill 0.6)
  Top 0.406: v70.7,37.7 POT4.2 | v70.7,49.77 68.58,49.77 R103.1
  Bottom 0.406: v70.7,49.77 v70.7,37.7
N$44
  Top 0.813: U$2.11 U$2.12 86.58,27.54 87.85,28.81 92.93,28.81 94.7,27.04 F1.1
N$45
  Top 0.813: U$2.10 U$2.9 82.13,21.83 66.39,21.83 F2.1
NRST  (via drill 0.6)
  Top 0.305: U1.7 38.2,25.52 v37.05,24.37
  Bottom 0.305: JP1.5 35.78,12.94 37.68,14.84 37.68,23.73 v37.05,24.37
PA4  (via drill 0.6)
  Top 0.305: U1.20 35.49,36.09 v35.78,36.43 | R403.2 35.66,49.23 v35.77,49.13
  Bottom 0.305: v35.77,49.13 v35.77,36.44 v35.78,36.43
  Bottom 0.406: 35.78,49.23 v35.77,49.13
PA5  (via drill 0.6)
  Top 0.305: U1.21 34.99,33.41 v34.51,33.89
  Top 0.406: v28.16,47.86 R503.2
  Bottom 0.305: v28.16,47.86 29.43,46.59 29.43,38.97 v34.51,33.89
SWCLK
  Top 0.305: U1.49 29.49,13.63 JP1.2
SWDIO
  Top 0.305: JP1.4 31.97,11.03 24.98,11.03 23.71,12.3 23.71,21.19 26.04,23.52 U1.46
SWO
  Top 0.305: U1.55 32.49,18.13 JP1.6
VCAP_1
  Top 0.305: U1.31 29.99,34.6 28.16,36.43 C3.1
VCAP_2
  Top 0.305: U1.47 26.81,23.02 24.98,21.19 C4.1
VDDA
  Top 0.305: U1.13 40.73,28.52 C8.1 C7.1 L1.1

### Text on the board
tPlace: Rebel Technology | MersenneTwister Rev 01 | GND | +5V | +12 | -12 | -12 | GND | +12 | +5V | GND | 3V3
bStop: -12